# EAGLE design humidity-v2.3 (EAGLE 5.11)
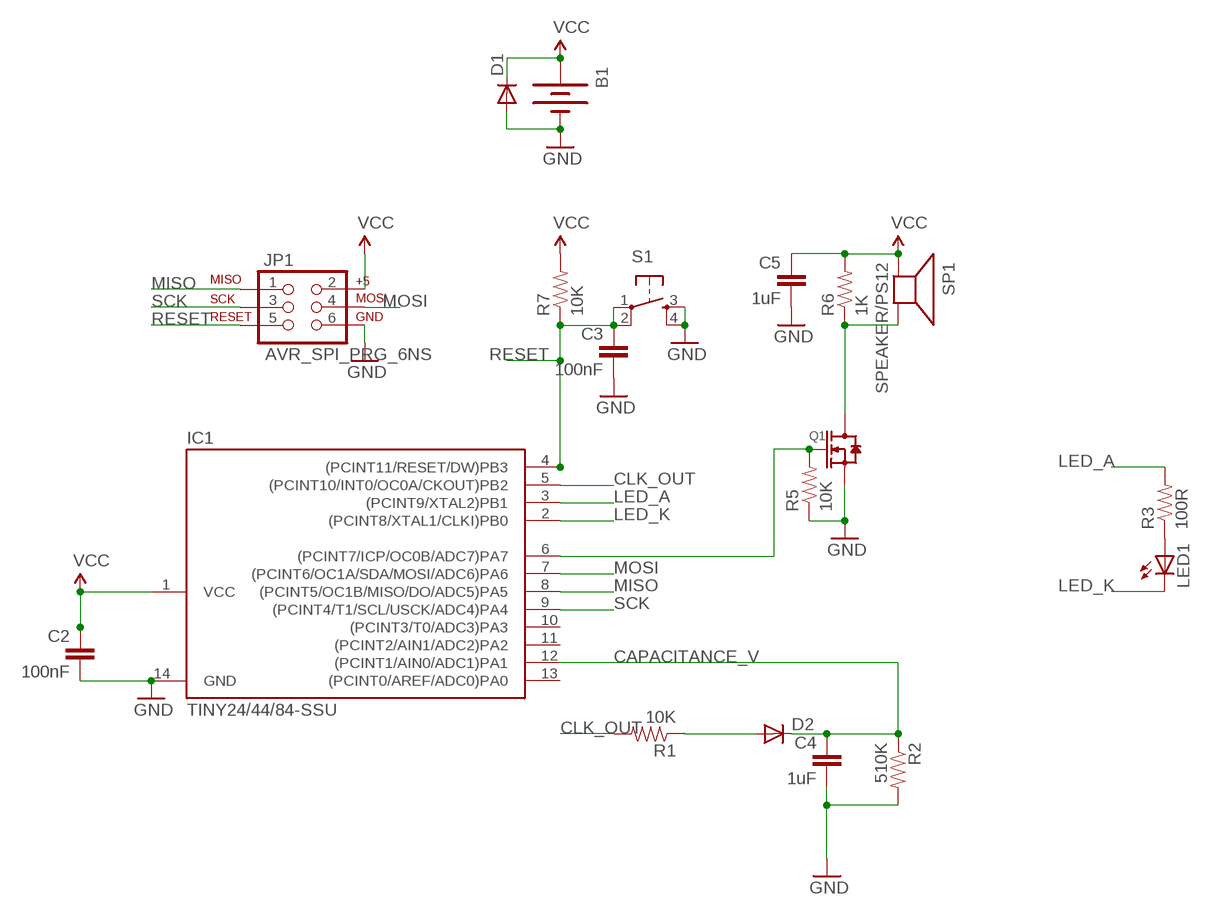
[diagram p0: schematic, sheet 1]

## Parts
B1  BATTERY  [BAT-HLD-001]
C2  100nF  CAP0603-CAP  [0603-CAP]
C3  100nF  CAP0603-CAP  [0603-CAP]
C4  1uF  CAP0603-CAP  [0603-CAP]
C5  1uF  CAP0603-CAP  [0603-CAP]
D1  DIODE-SOD80C  [SOD80C]
D2  DIODE-SCHOTTKY_  DIODESOD-523  [SOD-523]
IC1  TINY24/44/84-SSU  [SOIC14]
JP1  AVR_SPI_PRG_6NS  [2X3-NS]
LED1  LEDCHIPLED_0805  [CHIPLED_0805]
Q1  MOSFET-N-SOT23  [SOT23]
R1  10K  RESISTOR0603-RES  [0603-RES]
R2  510K  RESISTOR0603-RES  [0603-RES]
R3  100R  RESISTOR0603-RES  [0603-RES]
R5  10K  RESISTOR0603-RES  [0603-RES]
R6  1K  RESISTOR0603-RES  [0603-RES]
R7  10K  RESISTOR0603-RES  [0603-RES]
S1  TAC_SWITCHPTH  [TACTILE-PTH]
SP1  SPEAKER/PS12  [PS12]

## Nets
BUZZER: IC1.6((PCINT7/ICP/OC0B/ADC7)PA7) Q1.1(G) R5.2
CAPACITANCE_V: C4.1 D2.K(C) IC1.12((PCINT1/AIN0/ADC1)PA1) R2.1
CLK_OUT: IC1.5((PCINT10/INT0/OC0A/CKOUT)PB2) R1.2
GND: B1.2(-) C2.2 C3.2 C4.2 C5.2 D1.A IC1.14(GND) JP1.6 Q1.2(S) R2.2 R5.1 S1.3 S1.4
LED_A: IC1.3((PCINT9/XTAL2)PB1) R3.2
LED_K: IC1.2((PCINT8/XTAL1/CLKI)PB0) LED1.C
MISO: IC1.8((PCINT5/OC1B/MISO/DO/ADC5)PA5) JP1.1
MOSI: IC1.7((PCINT6/OC1A/SDA/MOSI/ADC6)PA6) JP1.4
N$1: Q1.3(D) R6.1 SP1.P$2(-)
N$2: LED1.A R3.1
RESET: C3.1 IC1.4((PCINT11/RESET/DW)PB3) JP1.5 R7.1 S1.1 S1.2
SCK: IC1.9((PCINT4/T1/SCL/USCK/ADC4)PA4) JP1.3
V_CAP: D2.A R1.1
VCC: B1.1(+) C2.1 C5.1 D1.C IC1.1(VCC) JP1.2 R6.2 R7.2 SP1.P$1(+)
Unconnected: IC1.10((PCINT3/T0/ADC3)PA3) IC1.11((PCINT2/AIN1/ADC2)PA2) IC1.13((PCINT0/AREF/ADC0)PA0)

## Library data of the parts
B1 = SparkFun:BATTERY: Battery Holders Various common sizes : AA, AAA, 20mm coin cell and 12mm coin cell.
C2-C5 = SparkFun:CAP: Capacitor Standard 0603 ceramic capacitor, and 0.1" leaded capacitor.
D1 = diode:DIODE-: DIODE
D2 = microbuilder:DIODE: Diode SMADIODE - SMA Surface Mount Package 20V 1A Schottky Diode Digikey (500mV @ 1A, 500uA Vr @ 20V): 641-1014-6-ND 10V 2A Schottky Diode Digikey (350mV @ 2A, 700uA Vr @ 10V): MBRA210LT3 SOD-123 30V 200mA (800mV Vf, 2uA Vr @ 25V) Schottky Diode (very fast switching for boost, etc.) - Digikey: BAT54T1GOSTR-ND 30V 500mA (430mV Vf, 130uA Vr @ 30V) Schottky Diode - Digikey: B0530W-FDICT-ND MBR120 1A 20V (0.34Vf) Schottky Diode - Digikey: MBR120VLSFT1GOSCT-ND SOD-323 10V 570mA (380mV Vf, 3ns) Schottky Diode - Digikey: ZLLS410CT-ND 1N4148WS - 75V 150mA (1V Vf @ 10mA, 4ns) Simple Diode - Digikey: 1N4148WSFSCT-ND, Mouser: 512-1N4148WS SOD-523 BAT54 30V 200mA Schottky (0.8 Vf @ 100mA, 5ns) - Digikey: BAT54XV2CT-ND 30V 30mA Schottky Diode (RB751S-40TE61) - Digikey: RB751S-40TE61CT-ND SOT23-R/W - SOT23 Package (R = Solder Paste/Reflow Ovens, W = Hand-Soldering) BAT54Film 40V 300mA - Digikey: 497-7162-1-ND DO-1N4148 Through Hole Small Current Diode (any model)
IC1 = avr-5:TINY24/44/84
JP1 = SparkFun:AVR_SPI_PRG_6: AVR ISP 6 Pin This is the reduced ISP connector for AVR programming. Common on Arduino. This footprint will take up less PCB space and can be used with a 10-pin to 6-pin adapter such as SKU: BOB-08508
LED1 = adafruit:LED: LED OSRAM: - CHIPLED LG R971, LG N971, LY N971, LG Q971, LY Q971, LO R971, LY R971 LH N974, LH R974 LS Q976, LO Q976, LY Q976 LO Q996 - Hyper CHIPLED LW Q18S LB Q993, LB Q99A, LB R99A - SideLED LS A670, LO A670, LY A670, LG A670, LP A670 LB A673, LV A673, LT A673, LW A673 LH A674 LY A675 LS A676, LA A676, LO A676, LY A676, LW A676 LS A679, LY A679, LG A679 - Hyper Micro SIDELED® LS Y876, LA Y876, LO Y876, LY Y876 LT Y87S - SmartLED LW L88C, LW L88S LB L89C, LB L89S, LG L890 LS L89K, LO L89K, LY L89K LS L896, LA L896, LO L896, LY L896 - TOPLED LS T670, LO T670, LY T670, LG T670, LP T670 LSG T670, LSP T670, LSY T670, LOP T670, LYG T670 LG T671, LOG T671, LSG T671 LB T673, LV T673, LT T673, LW T673 LH T674 LS T676, LA T676, LO T676, LY T676, LB T676, LH T676, LSB T676, LW T676 LB T67C, LV T67C, LT T67C, LS T67K, LO T67K, LY T67K, LW E67C LS E67B, LA E67B, LO E67B, LY E67B, LB E67C, LV E67C, LT E67C LW T67C LS T679, LY T679, LG T679 LS T770, LO T770, LY T770, LG T770, LP T770 LB T773, LV T773, LT T773, LW T773 LH T774 LS E675, LA E675, LY E675, LS T675 LS T776, LA T776, LO T776, LY T776, LB T776 LHGB T686 LT T68C, LB T68C - Hyper Mini TOPLED® LB M676 - Mini TOPLED Santana® LG M470 LS M47K, LO M47K, LY M47K Source: http://www.osram.convergy.de/
Q1 = Seeed-Discrete:MOSFET-N
R1-R3 R5-R7 = SparkFun:RESISTOR: Resistor Basic schematic elements and footprints for 0603, 1206, and PTH resistors.
S1 = SparkFun:TAC_SWITCH: Momentary Switch Button commonly used for reset or general input. Spark Fun Electronics SKU : COM-00097
SP1 = adafruit:SPEAKER: SPEAKER Source: Buerklin Added PS12 (for part # PS1240 piezo) http://www.ladyada.net/library/pcb/eaglelibrary.html

## Board
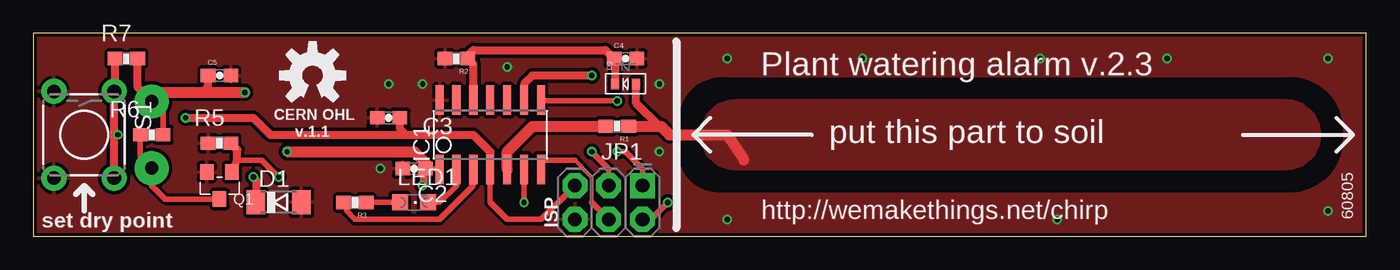
[diagram p1: board, top side]
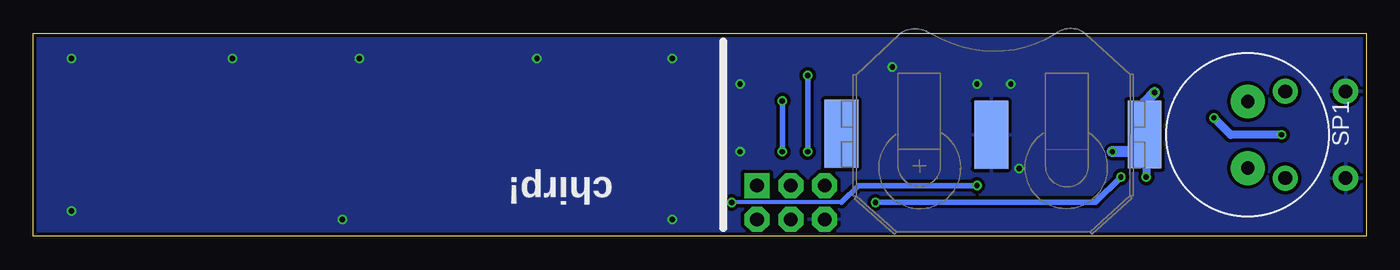
[diagram p2: board, bottom side, seen from below]

Size 100.03 x 15.23 mm. Coordinates in mm from the lower left corner, seen from the top.
Outline: 0,0 100.03,0 100.03,15.23 0,15.23 0,0
Copper layers (1*16): Top 0.035mm / dielectric 1.5mm / Bottom 0.035mm
Design rules "Fusion_eagle_rule_v1.1": minimum track width 6mil, minimum drill 12mil, track to track 6mil, track to pad 6mil, pad to pad 6mil, via to via 6mil, smd to smd 0mil, copper to edge 10mil, drill to drill 10mil, minimum pad ring 10mil, minimum via ring 6mil, stop-mask expansion 2mil, vias tented up to drill 100mil, thermal gap 10mil

### Footprints (pad centres in the part's own frame; a part is rotated, then mirrored left to right if it is on the bottom)
BAT-HLD-001 = smd 2.54 x 5.08: 1 -11.51,-0.02; 2 0,0; 3 11.25,-0.07
0603-CAP = smd 1.1 x 1: 1 -0.85,0; 2 0.85,0
SOD80C = smd 1.4 x 1.8: A 1.7,0; C -1.7,0
SOD-523 = smd 0.8 x 0.6: A 0,-0.8; K 0,0.8
SOIC14 = smd 0.61 x 2.21: 1 -3.81,-2.603; 2 -2.54,-2.603; 3 -1.27,-2.603; 4 0,-2.603; 5 1.27,-2.603; 6 2.54,-2.603; 7 3.81,-2.603; 8 3.81,2.603; 9 2.54,2.603; 10 1.27,2.603; 11 0,2.603; 12 -1.27,2.603; 13 -2.54,2.603; 14 -3.81,2.603
2X3-NS = drill 1.016 pad 1.88 square: 1 -2.54,-1.27 | drill 1.016 pad 1.88 octagon: 2 -2.54,1.27; 3 0,-1.27; 4 0,1.27; 5 2.54,-1.27; 6 2.54,1.27
CHIPLED_0805 = smd 1.2 x 1.2: A 0,-1.05; C 0,1.05
SOT23 = smd 1.016 x 1.143: 1 -0.95,-1.016; 2 0.95,-1.016; 3 0,1.016
0603-RES = smd 1.1 x 1: 1 -0.85,0; 2 0.85,0
TACTILE-PTH = drill 1.016 pad 1.88 round: 1 -3.251,2.261; 2 3.251,2.261; 3 -3.251,-2.261; 4 3.251,-2.261
PS12 = drill 1 pad 2.54 round: P$1 -2.5,0; P$2 2.5,0

### Placement (x,y rotation side)
B1  28.14,7.62 180 bottom
C2  28.57,5.08 180 top
C3  26.67,8.89 180 top
C4  44.45,13.34 0 top
C5  13.97,12.06 0 top
D1  18.41,2.54 0 top
D2  44.45,11.43 90 top
IC1  34.29,7.62 0 top
JP1  43.18,2.54 180 top
LED1  28.57,2.54 270 top
Q1  13.97,3.81 180 top
R1  43.81,8.26 180 top
R2  31.75,13.34 180 top
R3  24.13,2.54 180 top
R5  13.97,6.99 0 top
R6  8.89,7.62 0 top
R7  6.99,13.34 0 top
S1  3.81,7.62 270 top
SP1  8.89,7.62 270 bottom

### Tracks (layer width: path | path; a pad name or v marks a point on that pad's centre or on a via)
BUZZER  (via drill 0.4 pad 0.3)
  Top 0.406: v36.83,2.54 IC1.6 | v18.41,4.45 17.14,5.71 15.31,5.71
  Top 0.61: Q1.1 15.31,5.71 15.31,6.5 R5.2
  Bottom 0.406: v36.83,2.54 20.32,2.54 v18.41,4.45
CAPACITANCE_V
  Top 0.406: 33.02,12.91 R2.1 32.6,13.55
  Top 0.61: 33.02,12.91 IC1.12 | 32.6,13.55 33.02,13.97 42.94,13.97 C4.1 43.65,13.29 D2.K
CLK_OUT
  Top 0.813: IC1.5 35.56,6.35 37.47,8.26 R1.2
GND  (via drill 0.4 pad 0.3)
  other vias: 26.67,11.43 29.21,11.43 26.04,5.08 46.99,6.35 35.56,12.7 46.99,11.43 52.07,13.34 62.23,13.34 75.56,13.34 85.09,13.34 97.16,13.34 97.16,1.91 76.83,1.27 52.07,1.27
  pour Top (isolate 0.254): 0,15.24 0,0 48.26,0 48.26,15.24
  pour Bottom (isolate 0.254): 0,15.24 99.69,15.24 99.69,0 0,0
  pour Top (isolate 0.254, no thermals): 48.26,15.24 99.69,15.24 99.69,0 46.99,0 46.99,6.35 48.26,6.35 arc90 51.44,3.17 93.98,3.17 arc90 98.42,6.99 98.42,8.26 arc90 93.98,12.06 52.07,12.06 arc90 48.26,8.89
LED_A
  Top 0.406: IC1.3 33.02,3.81 30.48,1.27 24.13,1.27 23.5,1.91 23.5,2.33 R3.2
LED_K
  Top 0.406: IC1.2 31.75,3.81 30.48,2.54 LED1.C
MISO  (via drill 0.4 pad 0.3)
  Top 0.406: JP1.1 45.72,5.08 44.45,6.35 v43.81,6.35 | v43.81,10.16 38.16,10.16 IC1.8
  Bottom 0.406: v43.81,6.35 v43.81,10.16
MOSI
  Top 0.305: 41.91,2.54 41.91,4.45 40.64,5.71
  Top 0.406: 41.91,2.54 JP1.4 | 40.64,5.71 38.16,5.71 IC1.7
N$1
  Top 0.406: Q1.3 9.91,2.79 8.89,3.81 SP1.P$2 8.04,5.97 R6.1
N$2
  Top 0.406: R3.1 LED1.A
RESET  (via drill 0.4 pad 0.3)
  Top 0.406: JP1.5 38.1,1.27 35.56,1.27 34.29,2.54 IC1.4 | S1.2 6.11,4.33 | S1.1 6.13,10.94
  Top 0.61: S1.1 S1.2 6.07,7.98 v6.35,7.62 | v11.43,8.89 16.51,8.89 17.78,7.62 27.94,7.62 | 27.94,7.62 33.02,7.62 34.29,6.35 IC1.4 | 6.13,10.94 R7.1 | C3.1 27.55,8.02 27.94,7.62
  Bottom 0.61: v6.35,7.62 10.16,7.62 v11.43,8.89
SCK  (via drill 0.4 pad 0.3)
  Top 0.406: JP1.3 43.18,5.08 v41.91,6.35
  Top 0.61: v41.91,12.06 37.47,12.06 36.83,11.43 IC1.9
  Bottom 0.406: v41.91,6.35 v41.91,12.06
V_CAP
  Top 0.61: 46.99,8.26 45.25,9.99 D2.A
  Top 0.813: 53.32,5.74 52.07,7.62 47.74,7.62 47.11,8.26 46.99,8.26 R1.1
  pour Top (no thermals): 50.16,7.62 arc-90 52.7,10.16 93.98,10.16 arc-90 96.52,7.62 arc-90 93.98,5.08 52.7,5.08 arc-90
VCC  (via drill 0.4 pad 0.3)  (1 unrouted)
  Top 0.406: JP1.2 46.35,1.27 v47.62,2.54 | 29.27,3.81 v29.21,3.81 | C2.1 30.42,5.08 | R6.2 9.74,9.27 SP1.P$1
  Top 0.61: 29.27,3.81 29.27,4.93 C2.1 | C5.1 13.12,11.21 12.7,10.79 | R7.2 7.83,11.18 SP1.P$1 | D1.C 16.71,4.24 v16.51,4.45
  Top 0.813: v15.88,10.79 12.7,10.79 9.56,10.79 SP1.P$1 | C2.1 29.45,5.47 28.57,6.35 v19.05,6.35
  Bottom 0.305: 39.37,2.54 v47.62,2.54
  Bottom 0.406: 39.37,2.54 38.1,3.81 v29.21,3.81 | B1.1 17.92,6.35
  Bottom 0.61: 16.63,10.04 B1.1 16.51,7.52 v16.51,4.45
  Bottom 0.813: v15.88,10.79 16.63,10.04 | 17.92,6.35 v19.05,6.35

### Text on the board
_tsilk: Plant watering alarm v.2.3 | CERN OHL | v.1.1 | put this part to soil | set dry point | ISP | http://wemakethings.net/chirp | 60805
_bsilk: chirp!